# Altium schematic sheet Buck_converter.SchDoc
size B
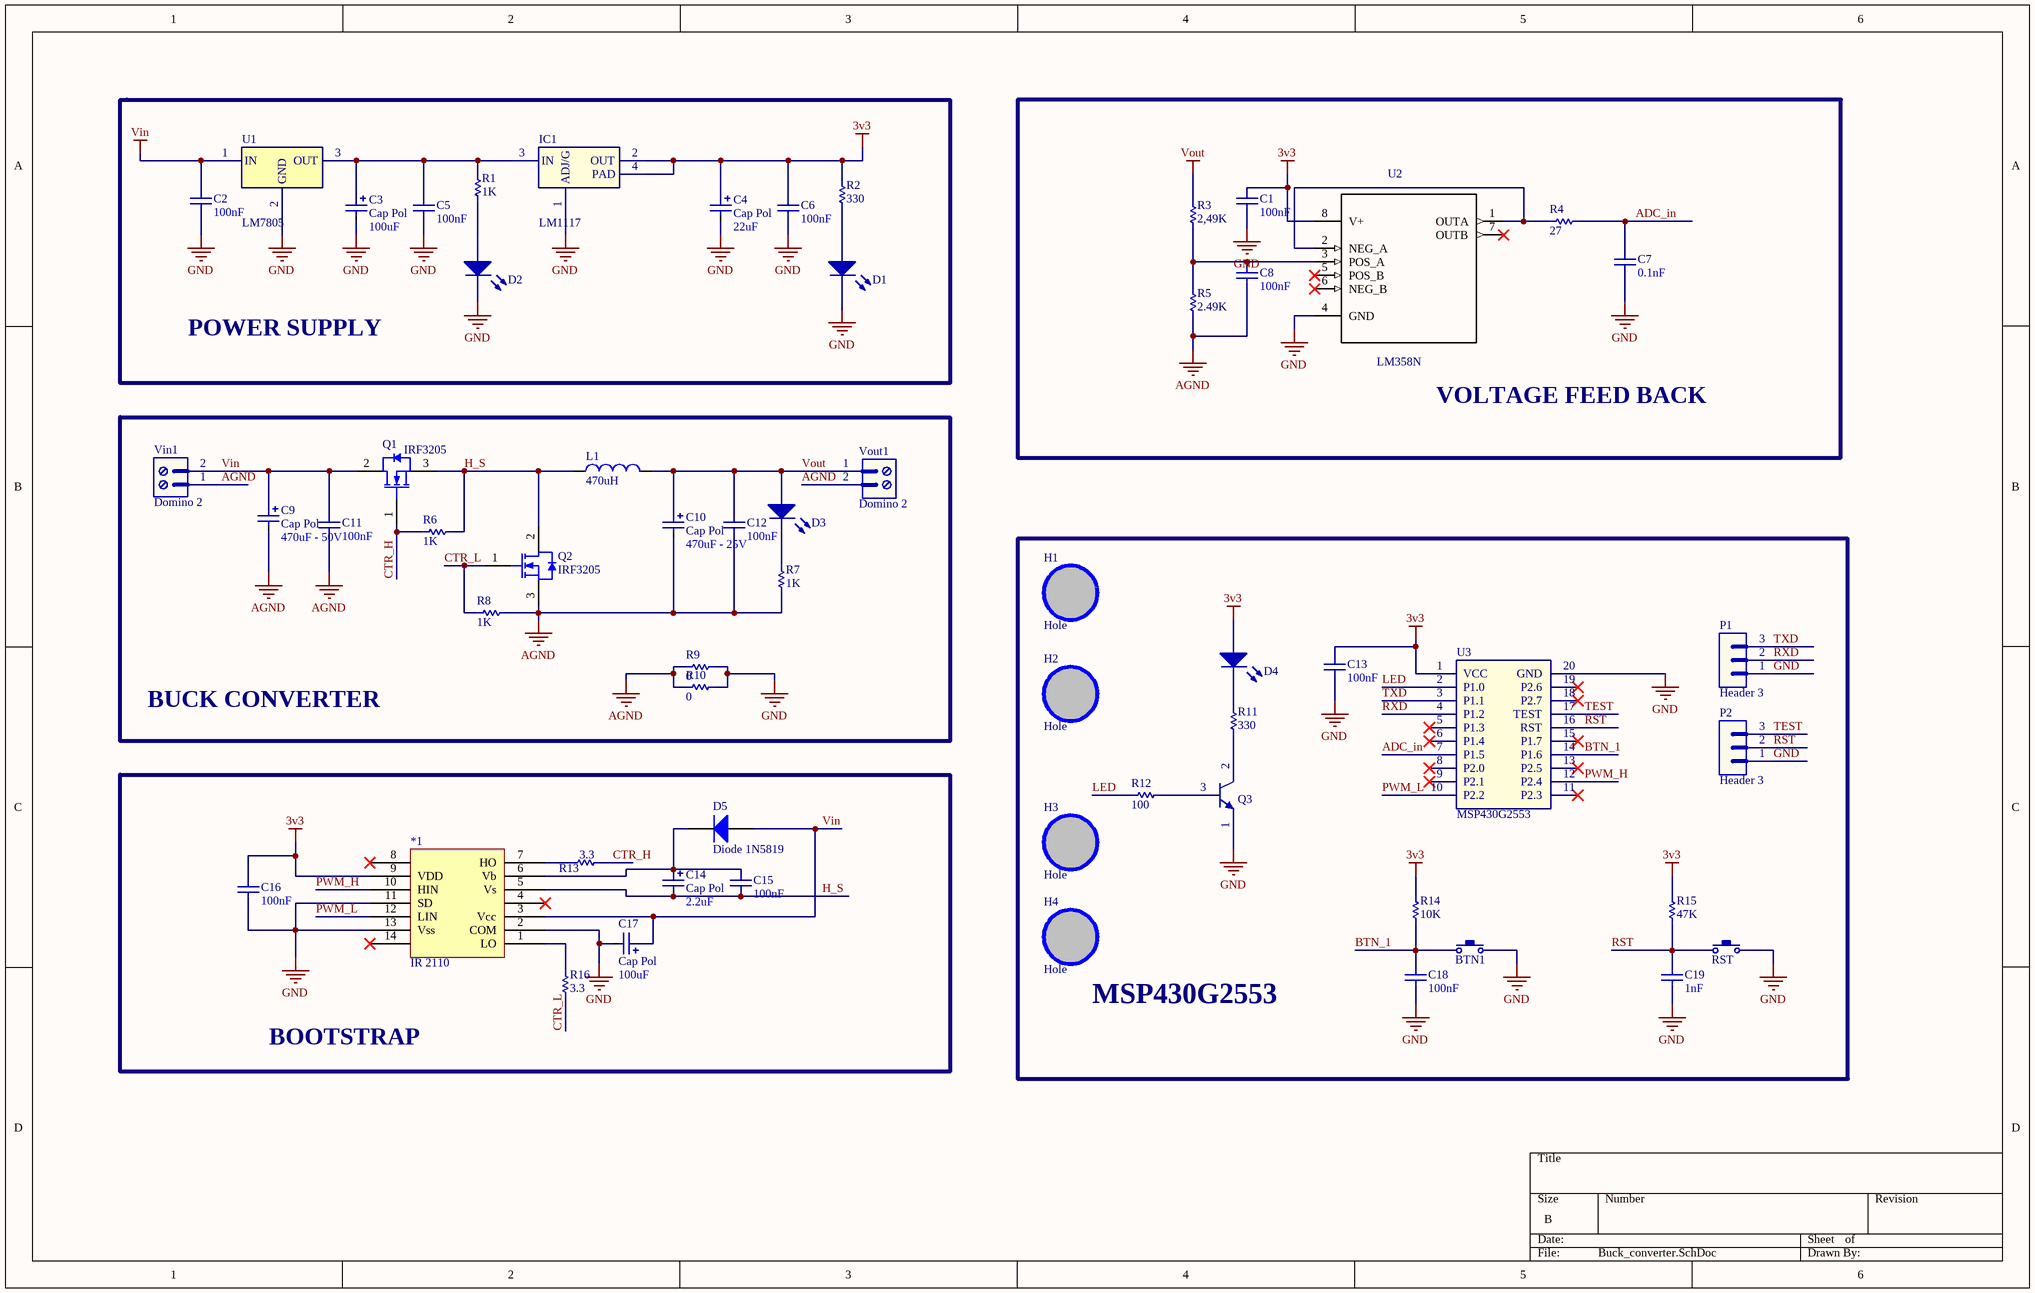
[diagram p0: Buck_converter.SchDoc]

## Parts
*1  IR 2110  [IR 2110 DIP14]
BTN1  Button  [Button]  (value not drawn)
C1  value 100nF  [CAP-SM-0805]  (hidden comment: Cap Non-Pol SMD)
C2  value 100nF  [CAP-SM-0805]  (hidden comment: Cap Non-Pol SMD)
C3  Cap Pol  value 100uF  [CP1/2]
C4  Cap Pol  value 22uF  [CP1/2]
C5  value 100nF  [CAP-SM-0805]  (hidden comment: Cap Non-Pol SMD)
C6  value 100nF  [CAP-SM-0805]  (hidden comment: Cap Non-Pol SMD)
C7  value 0.1nF  [CAP-SM-0805]  (hidden comment: Cap Non-Pol SMD)
C8  value 100nF  [CAP-SM-0805]  (hidden comment: Cap Non-Pol SMD)
C9  Cap Pol  value 470uF - 50V  [CP3/7]
C10  Cap Pol  value 470uF - 25V  [CP1.5/3.4]
C11  value 100nF  [CN1]  (hidden comment: Cap Non-Pol)
C12  value 100nF  [CN1]  (hidden comment: Cap Non-Pol)
C13  value 100nF  [CAP-SM-0805]  (hidden comment: Cap Non-Pol SMD)
C14  Cap Pol  value 2.2uF  [CP1/2]
C15  value 100nF  [CN1]  (hidden comment: Cap Non-Pol)
C16  value 100nF  [CAP-SM-0805]  (hidden comment: Cap Non-Pol SMD)
C17  Cap Pol  value 100uF  [CP1/2]
C18  value 100nF  [CAP-SM-0805]  (hidden comment: Cap Non-Pol SMD)
C19  value 1nF  [CAP-SM-0805]  (hidden comment: Cap Non-Pol SMD)
D1  LED  [LED-3mm]  (value not drawn)
D2  LED  [LED-3mm]  (value not drawn)
D3  LED  [LED-3mm]  (value not drawn)
D4  LED  [LED-3mm]  (value not drawn)
D5  Diode 1N5819  [DO-41]
H1  Hole  [LO KHOAN 3MM]
H2  Hole  [LO KHOAN 3MM]
H3  Hole  [LO KHOAN 3MM]
H4  Hole  [LO KHOAN 3MM]
IC1  LM1117  [SOT223-4N]
L1  value 470uH  [INDUCTOR 12.5x12.5]  (hidden comment: Inductor)
P1  Header 3  [JP3]
P2  Header 3  [JP3]
Q1  IRF3205  [INF-PG-TO220-3-1]
Q2  IRF3205  [INF-PG-TO220-3-1]
Q3  Transistor C1815  [SOT23-3 Leads]  (value not drawn)
R1  value 1K  [RES-SM-0805]  (hidden comment: Resistor 1/4W)
R2  value 330  [RES-SM-0805]  (hidden comment: Resistor 1/4W)
R3  value 2,49K  [RES-SM-0805]  (hidden comment: Resistor 1/4W)
R4  value 27  [RES-SM-0805]  (hidden comment: Resistor 1/4W)
R5  value 2.49K  [RES-SM-0805]  (hidden comment: Resistor 1/4W)
R6  value 1K  [RES 1/2W]  (hidden comment: Resistor 1/4W)
R7  value 1K  [RES-SM-0805]  (hidden comment: Resistor 1/4W)
R8  value 1K  [RES-SM-0805]  (hidden comment: Resistor 1/4W)
R9  value 0  [RES-SM-0805]  (hidden comment: Resistor 1/4W)
R10  value 0  [RES-SM-0805]  (hidden comment: Resistor 1/4W)
R11  value 330  [RES-SM-0805]  (hidden comment: Resistor 1/4W)
R12  value 100  [RES-SM-0805]  (hidden comment: Resistor 1/4W)
R13  value 3.3  [RES-SM-0805]  (hidden comment: Resistor 1/4W)
R14  value 10K  [RES-SM-0805]  (hidden comment: Resistor 1/4W)
R15  value 47K  [RES-SM-0805]  (hidden comment: Resistor 1/4W)
R16  value 3.3  [RES-SM-0805]  (hidden comment: Resistor 1/4W)
RST  Button  [Button]  (value not drawn)
U1  LM7805  [QTO-220]
U2  LM358N  [DIP254P762X508-8]
U3  MSP430G2553  [DIP20/W0.3]
Vin1  Domino 2  [DOMINO 2- 5mm]
Vout1  Domino 2  [DOMINO 2- 5mm]

## Blocks framed on the sheet
POWER SUPPLY: C2-C6 D1 D2 IC1 R1 R2 U1
VOLTAGE FEED BACK: C1 C7 C8 R3-R5 U2
BUCK CONVERTER: C9-C12 D3 L1 Q1 Q2 R6-R10 Vin1 Vout1
MSP430G2553: BTN1 C13 C18 C19 D4 H1-H4 P1 P2 Q3 R11 R12 R14 R15 RST U3
BOOTSTRAP: *1 C14-C17 D5 R13 R16

## Nets
3v3: *1.9(VDD) C1.2 C4.1 C6.2 C13.2 C16.2 D4.1(A) IC1.2(OUT) IC1.4(PAD) R2.2 R14.2 R15.2 U2.8(V+) U3.1(VCC)
AGND: C8.1 C9.2 C10.2 C11.1 C12.1 Q2.3(SOURCE) R5.1 R7.1 R8.2 R9.1 R10.1 Vin1.1 Vout1.2
GND: *1.2(COM) *1.11(SD) *1.13(Vss) BTN1.2 C1.1 C2.1 C3.2 C4.2 C5.1 C6.1 C7.1 C13.1 C16.1 C17.2 C18.2 C19.1 D1.2(K) D2.2(K) IC1.1(ADJ/G) P1.1 P2.1 Q3.1(E) R9.2 R10.2 RST.2 U1.2(GND) U2.4(GND) U3.20(GND)
Vin: *1.3(Vcc) C2.2 C9.1 C11.2 C17.1 D5.1(A) Q1.2(DRAIN) U1.1(IN) Vin1.2
Vout: C10.1 C12.2 D3.1(A) L1.2 R3.2 Vout1.1
ADC_in: C7.2 R4.2 U3.7(P1.5)
BTN_1: BTN1.1 C18.1 R14.1 U3.14(P1.6)
CTR_H: Q1.1(GATE) R6.1 R13.2
CTR_L: Q2.1(GATE) R8.1 R16.1
H_S: *1.5(Vs) C14.2 C15.1 L1.1 Q1.3(SOURCE) Q2.2(DRAIN) R6.2
LED: R12.1 U3.2(P1.0)
PWM_H: *1.10(HIN) U3.12(P2.4)
PWM_L: *1.12(LIN) U3.10(P2.2)
RST: C19.2 P2.2 R15.1 RST.1 U3.16(RST)
RXD: P1.2 U3.4(P1.2)
TEST: P2.3 U3.17(TEST)
TXD: P1.3 U3.3(P1.1)
Net*1_1: *1.1(LO) R16.2
Net*1_6: *1.6(Vb) C14.1 C15.2 D5.2(K)
Net*1_7: *1.7(HO) R13.1
NetC3_1: C3.1 C5.2 IC1.3(IN) R1.2 U1.3(OUT)
NetC8_2: C8.2 R3.1 R5.2 U2.3(POS_A)
NetD1_1: D1.1(A) R2.1
NetD2_1: D2.1(A) R1.1
NetD3_2: D3.2(K) R7.2
NetD4_2: D4.2(K) R11.2
NetQ3_2: Q3.2(C) R11.1
NetQ3_3: Q3.3(B) R12.2
NetR4_1: R4.1 U2.1(OUTA) U2.2(NEG_A)

Not connected (* = marked no-connect by the designer): *1 4* 8* 14*; H1 1; H2 1; H3 1; H4 1; U2 5(POS_B)* 6(NEG_B)* 7(OUTB)*; U3 5(P1.3)* 6(P1.4)* 8(P2.0)* 9(P2.1)* 11(P2.3)* 13(P2.5)* 15(P1.7)* 18(P2.7)* 19(P2.6)*

## Library data of the parts
C1 C2 C5-C8 C13 C16 C18 C19 = Cap Non-Pol SMD: Capacitor
C3 C4 C9 C10 C14 C17 = Cap Pol: Polarized Capacitor (Radial)
C11 C12 C15 = Cap Non-Pol: Capacitor
D5 = Diode 1N4001: 1 Amp General Purpose Rectifier; Published: 8-Jun-2000; LatestRevisionDate: 17-Jul-2002; LatestRevisionNote: Re-released for DXP Platform.; DatasheetVersion: 1998; PackageVersion: Aug-1999; PackageReference: DO-41; Publisher: Altium Limited; PackageDescription: Diode, Axial; Body 5.2 x 2.7 mm (LxDia. max), Lead Dia. 0.86 mm (max); Code_JEDEC: DO-204-AL; ComponentLink1Description: Manufacturer Link; ComponentLink1URL: http://www.fairchildsemi.com/; ComponentLink2Description: Datasheet; ComponentLink2URL: http://www.fairchildsemi.com/ds/1N%2F1N4001.pdf
H1-H4 = Hole: Hole 3mm
IC1 = LM1117: Available in 1.8V, 2.5V, 2.85V, 3.3V, 5V, and  Adjustable Versions; Value: LM317
P1 P2 = Header 3: Header, 3-Pin; LatestRevisionDate: 17-Jul-2002; LatestRevisionNote: Re-released for DXP Platform.; Publisher: Altium Limited
Q1 Q2 = IPP039N04L G: N-Channel OptiMOS 3 Power-Transistor, 40 V VDS, 80 A ID, -55 to 175 degC, PG-TO220-3-1, Tube, Green; Manufacturer: Infineon; Green: TRUE; ID (max): 80 A; IDpuls (max): 400 A; Polarity: N; Ptot (max): 94 W; QG: 28 nC; RDS (on) (max): 3.9 mOhm; RDS (on) (max) (@4.5V): 5.2 mOhm; Rth: 1.6 K/W; RthJA (max): 62 K/W; VDS (max): 40 V; VGS(th) (max): 2 V; VGS(th) (min): 1.2 V; DatasheetVersion: Rev. 1.0; PackageVersion: Jul-12; PackageReference: PG-TO220-3-1; PackageDescription: 3-Pin Plastic (Green) Transistor Single Outline Package, 10 x 9.25 mm Body, 2.54 mm Pitch; Supplier 1: Mouser; Supplier Part Number 1: 726-IPP039N04LG; Supplier 2: Newark; Supplier Part Number 2: 60R2732; Supplier 3: Farnell; Supplier Part Number 3: 1775618; Supplier 4: Digi-Key; Supplier Part Number 4: IPP039N04L G-ND; Halogen-free: TRUE; Packing: Tube; RthJC (max): 1.6 K/W; Mounting Technology: Through Hole; PartNumber: IPP039N04L G; ComponentLink1Description: Manufacturer URL; ComponentLink1URL: http://www.infineon.com/; ComponentLink2Description: Datasheet; ComponentLink2URL: http://www.infineon.com/dgdl/IPB039N04L_rev1%5B1%5D.pdf?folderId=db3a304313b8b5a60113cee8763b02d7&fileId=db3a30432313ff5e01239f14ac947132; ComponentLink3Description: Package Specification; ComponentLink3URL: http://www.infineon.com/dgdl/BTS117_DS_14.pdf?folderId=db3a30431400ef68011421b54e2e0564&fileId=db3a30433a747525013abff8302d549c&location=en.Products.Automotive_ICs.Smart_High-_and_Low-Side_Switches.HITFET___TEMPFET__-_Smart_Low-Side_Switches.DATASHEET.BTS117_DS_14.pdf
Q3 = C1815
R1-R16 = RES
U1 = LM7805: Positive Voltage Regulator
U2 = LM358N: MF: STMicroelectronics; Package: DIP-8 Intersil; Price: 0.20 USD; SnapEDA_Link: https://www.snapeda.com/parts/LM358N/STMicroelectronics/view-part/?ref=snap; MP: LM358N; Availability: Warning; Value: *
U3 = MSP430G2553: IC MCU 16BIT 16KB FLASH
Vin1 Vout1 = Domino 2: Domino, 2-Pin; LatestRevisionDate: 17-Jul-2002; LatestRevisionNote: Re-released for DXP Platform.; Publisher: Altium Limited